# EAGLE schematic csa_cpu_v2.0h (EAGLE 4.15)
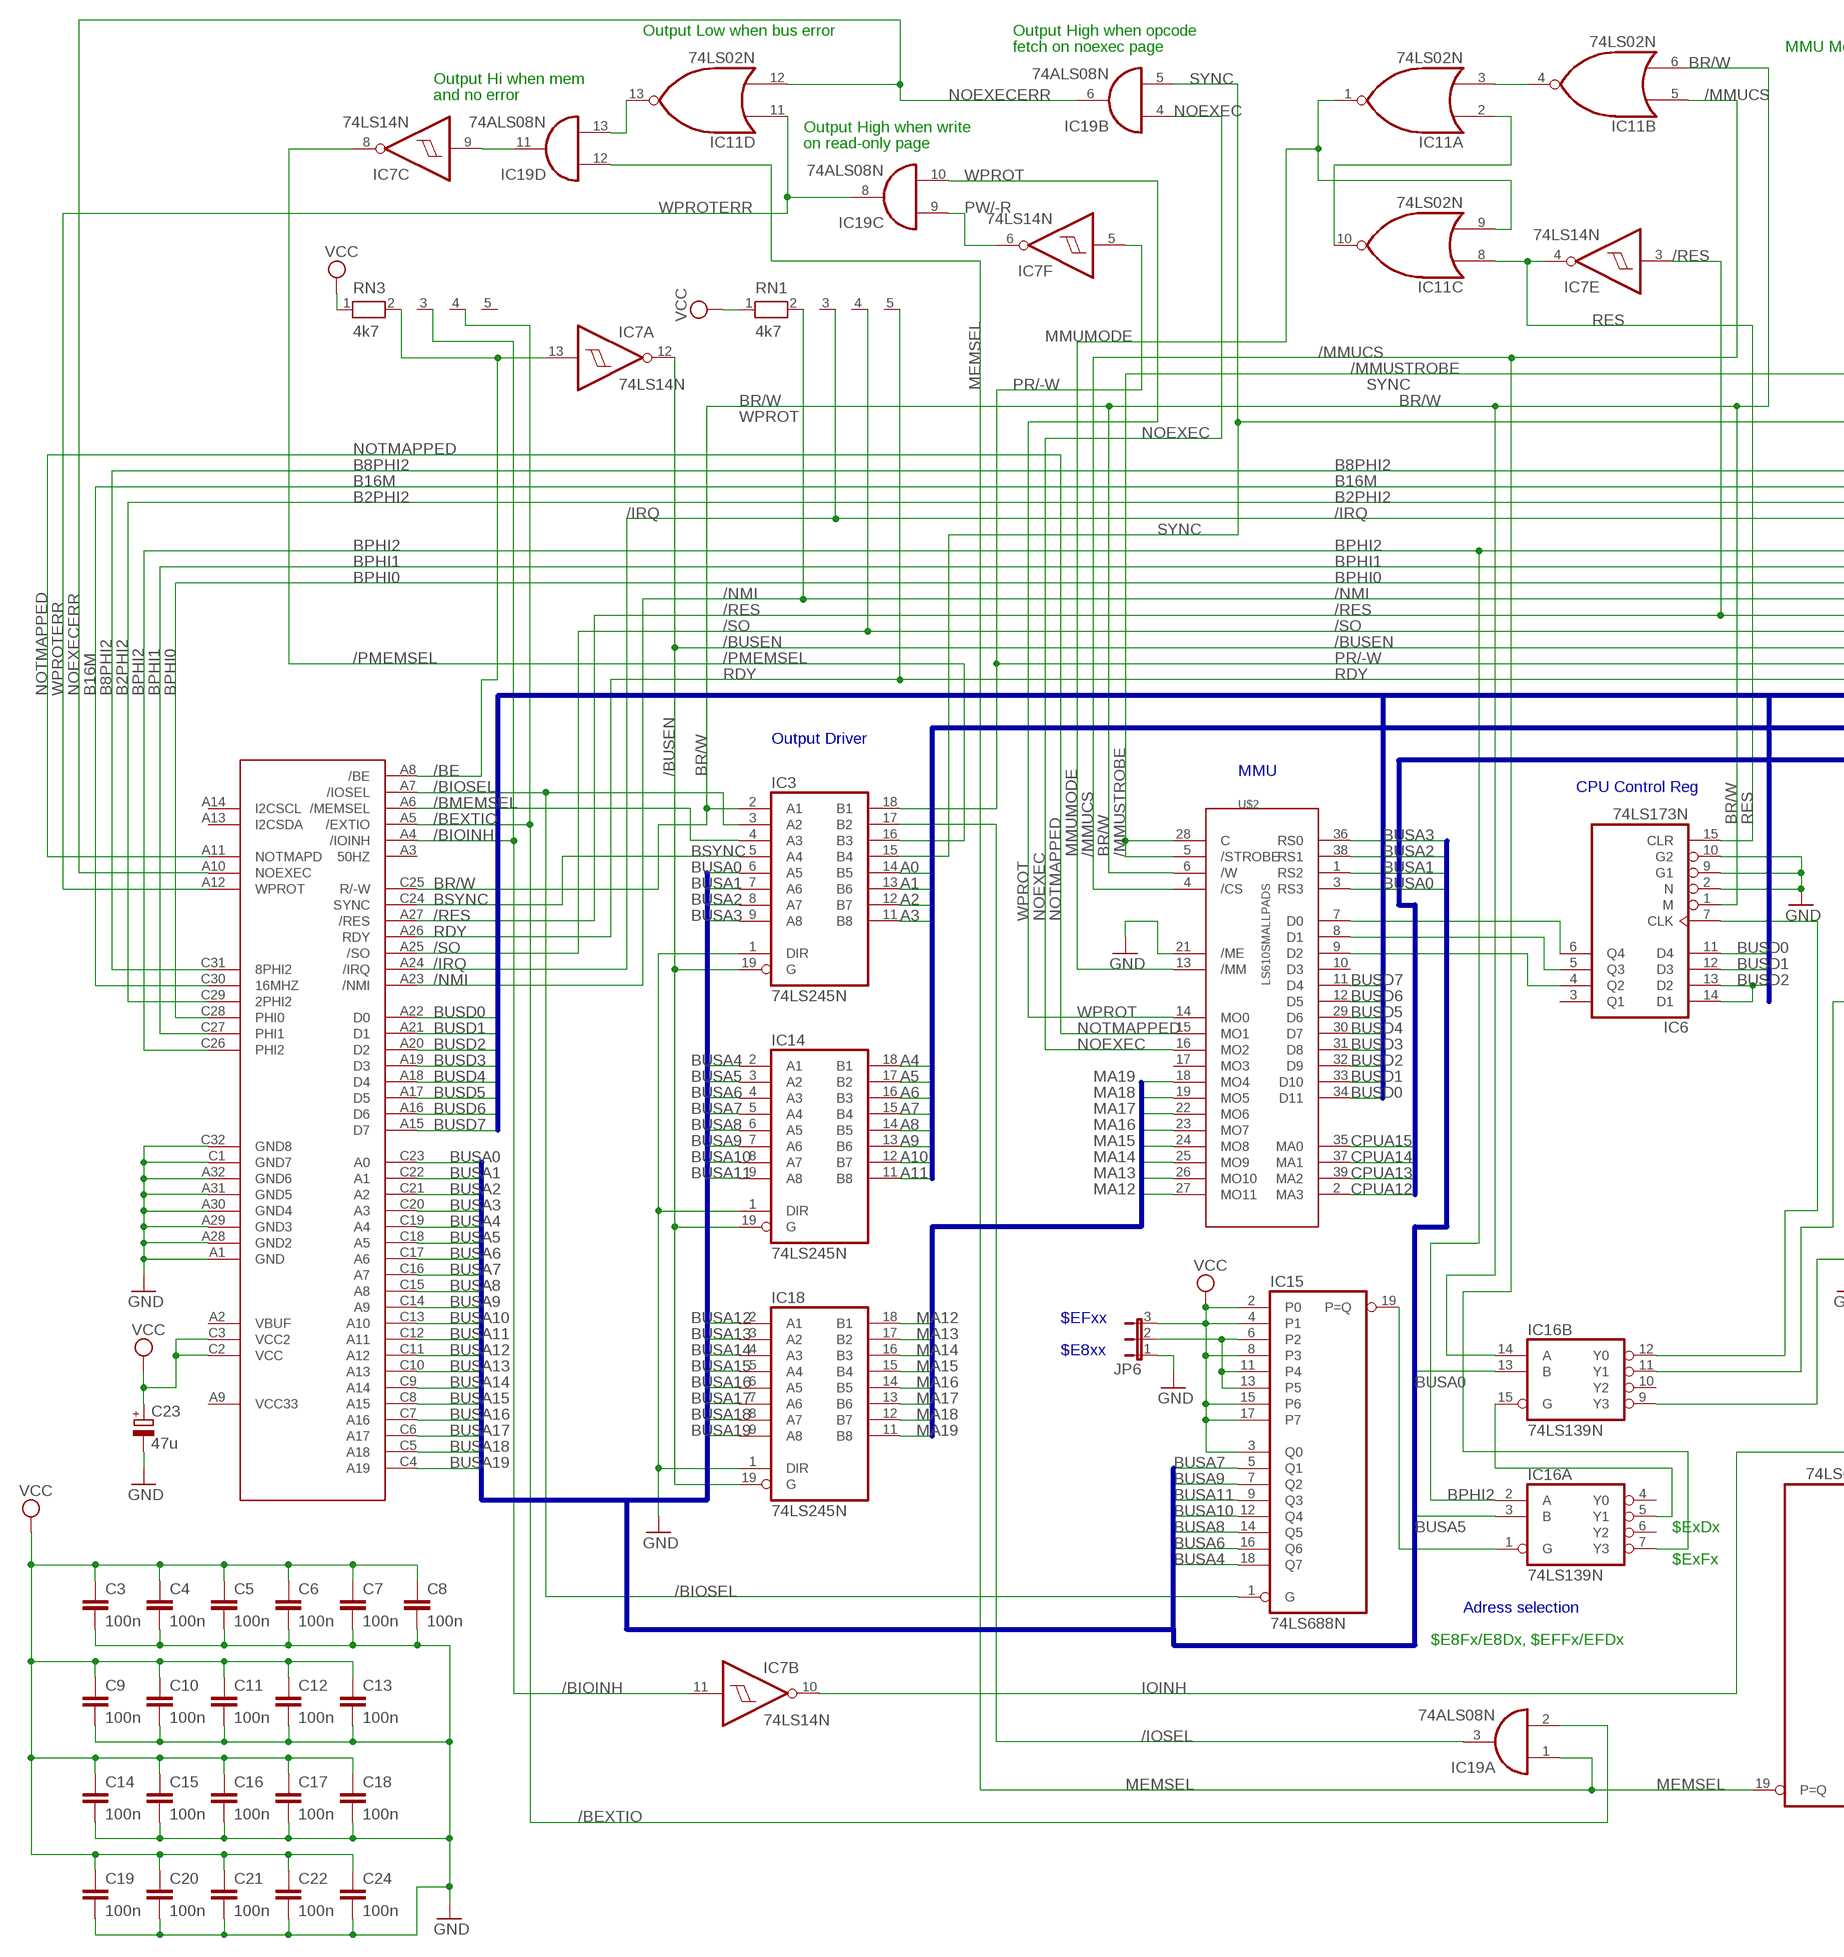
[diagram p0: schematic, sheet 1, part 1 of 2]
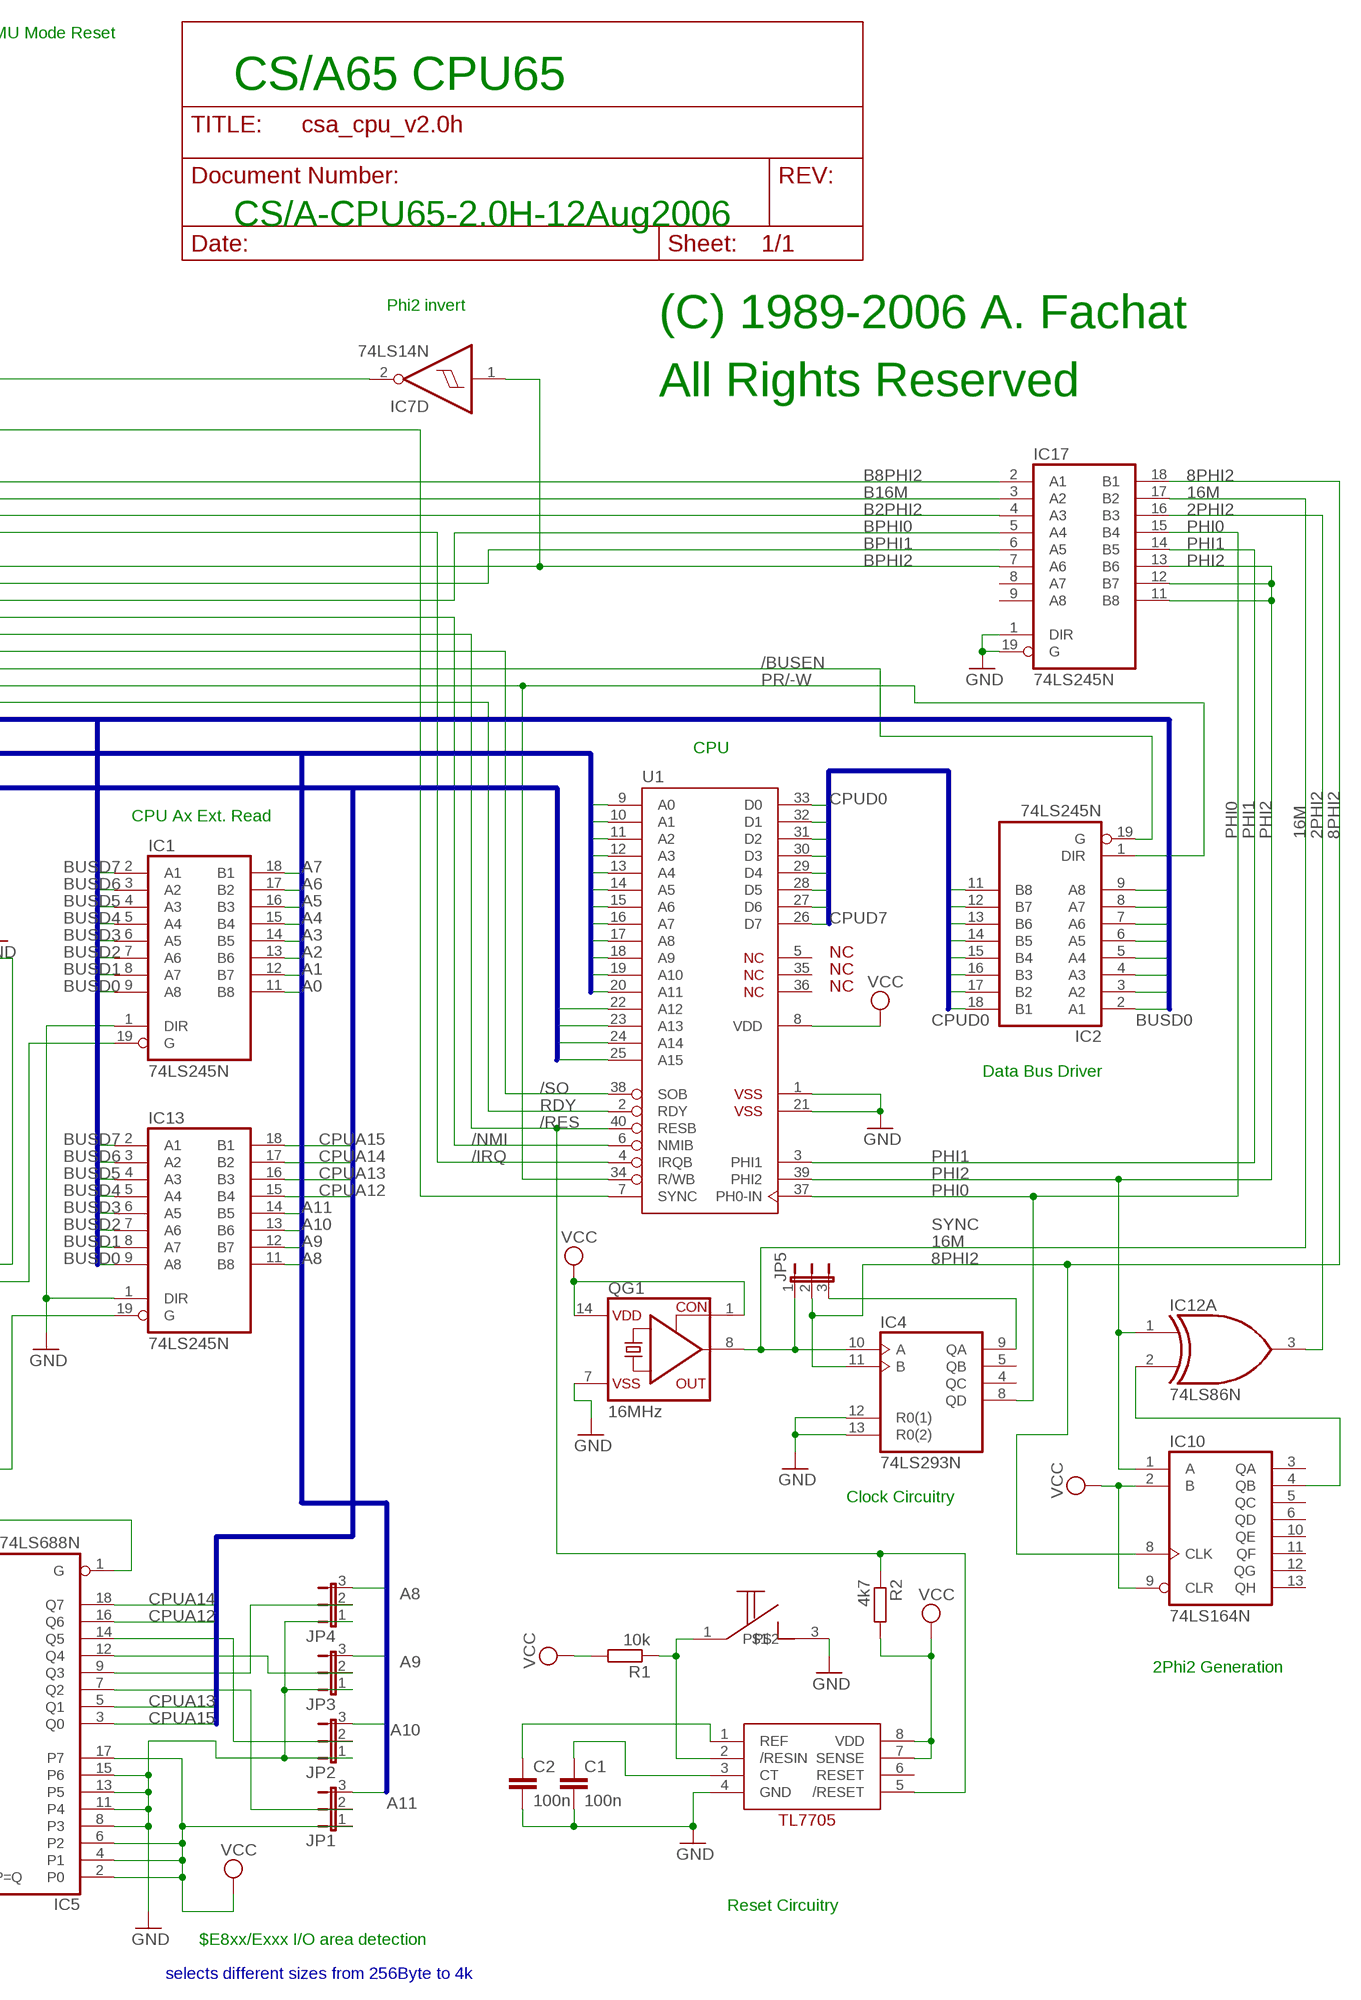
[diagram p1: schematic, sheet 1, part 2 of 2]

## Parts
C1  100n  C5/3.5  [C5B3.5]
C2  100n  C5/3.5  [C5B3.5]
C3  100n  C-EU025-025X050  [C025-025X050]
C4  100n  C-EU025-025X050  [C025-025X050]
C5  100n  C-EU025-025X050  [C025-025X050]
C6  100n  C-EU025-025X050  [C025-025X050]
C7  100n  C-EU025-025X050  [C025-025X050]
C8  100n  C-EU025-025X050  [C025-025X050]
C9  100n  C-EU025-025X050  [C025-025X050]
C10  100n  C-EU025-025X050  [C025-025X050]
C11  100n  C-EU025-025X050  [C025-025X050]
C12  100n  C-EU025-025X050  [C025-025X050]
C13  100n  C-EU025-025X050  [C025-025X050]
C14  100n  C-EU025-025X050  [C025-025X050]
C15  100n  C-EU025-025X050  [C025-025X050]
C16  100n  C-EU025-025X050  [C025-025X050]
C17  100n  C-EU025-025X050  [C025-025X050]
C18  100n  C-EU025-025X050  [C025-025X050]
C19  100n  C-EU025-025X050  [C025-025X050]
C20  100n  C-EU025-025X050  [C025-025X050]
C21  100n  C-EU025-025X050  [C025-025X050]
C22  100n  C-EU025-025X050  [C025-025X050]
C23  47u  CPOL-EUE2.5-7  [E2,5-7]
C24  100n  C-EU025-025X050  [C025-025X050]
IC1  74LS245N  [DIL20]
IC2  74LS245N  [DIL20]
IC3  74LS245N  [DIL20]
IC4  74LS293N  [DIL14]
IC5  74LS688N  [DIL20]
IC6  74LS173N  [DIL16]
IC7  74LS14N  [DIL14]
IC10  74LS164N  [DIL14]
IC11  74LS02N  [DIL14]
IC12  74LS86N  [DIL14]
IC13  74LS245N  [DIL20]
IC14  74LS245N  [DIL20]
IC15  74LS688N  [DIL20]
IC16  74LS139N  [DIL16]
IC17  74LS245N  [DIL20]
IC18  74LS245N  [DIL20]
IC19  74ALS08N  [DIL14]
JP1  JP2E  [JP2]
JP2  JP2E  [JP2]
JP3  JP2E  [JP2]
JP4  JP2E  [JP2]
JP5  JP2E  [JP2]
JP6  JP2E  [JP2]
QG1  16MHz  CRYSTAL_RES-SG51  [SG51]
R1  10k  R-EU_0207/10  [0207/10]
R2  4k7  R-EU_0207/10  [0207/10]
RN1  4k7  RN04  [RN-5]
RN3  4k7  RN04  [RN-5]
U1  G65SC02P  [DIP-40]
U$1  CSABUS  [CSABUS]
U$2  LS610SMALLPADS  [DIP40]
U$3  TL7705  [DIL08]
U$4  TASTER  [TASTER]

## Nets
2PHI2: IC12.3(A:O) IC17.16(B3)
8PHI2: IC4.11(B) IC10.8(CLK) IC17.18(B1) JP5.2
16M: IC4.10(A) IC17.17(B2) JP5.1 QG1.8(OUT)
/BE: IC7.13(A:I) RN3.2 U$1.A8(/BE)
/BEXTIO: IC19.2(A:I1) RN3.4 U$1.A5(/EXTIO)
/BIOINH: IC7.11(B:I) RN3.3 U$1.A4(/IOINH)
/BIOSEL: IC3.3(A2) IC15.1(G) U$1.A7(/IOSEL)
/BMEMSEL: IC3.4(A3) U$1.A6(/MEMSEL)
/BUSEN: IC2.19(G) IC3.19(G) IC7.12(A:O) IC14.19(G) IC18.19(G)
/IOSEL: IC3.17(B2) IC19.3(A:O)
/IRQ: RN1.3 U1.4(IRQB) U$1.A24(/IRQ)
/MMUCS: IC11.5(B:I0) IC16.7(A:Y3) U$2.4(/CS)
/MMUSTROBE: IC7.2(D:O) U$2.5(/STROBE) U$2.28(C)
/NMI: RN1.2 U1.6(NMIB) U$1.A23(/NMI)
/PMEMSEL: IC3.16(B3) IC7.8(C:O)
/RES: IC7.3(E:I) R2.1 U1.40(RESB) U$1.A27(/RES) U$3.5(/RESET)
/SO: RN1.4 U1.38(SOB) U$1.A25(/SO)
A0: IC1.11(B8) IC3.14(B5) U1.9(A0)
A1: IC1.12(B7) IC3.13(B6) U1.10(A1)
A2: IC1.13(B6) IC3.12(B7) U1.11(A2)
A3: IC1.14(B5) IC3.11(B8) U1.12(A3)
A4: IC1.15(B4) IC14.18(B1) U1.13(A4)
A5: IC1.16(B3) IC14.17(B2) U1.14(A5)
A6: IC1.17(B2) IC14.16(B3) U1.15(A6)
A7: IC1.18(B1) IC14.15(B4) U1.16(A7)
A8: IC13.11(B8) IC14.14(B5) JP4.3 U1.17(A8)
A9: IC13.12(B7) IC14.13(B6) JP3.3 U1.18(A9)
A10: IC13.13(B6) IC14.12(B7) JP2.3 U1.19(A10)
A11: IC13.14(B5) IC14.11(B8) JP1.3 U1.20(A11)
B2PHI2: IC17.4(A3) U$1.C29(2PHI2)
B8PHI2: IC17.2(A1) U$1.C31(8PHI2)
B16M: IC17.3(A2) U$1.C30(16MHZ)
BPHI0: IC17.5(A4) U$1.C28(PHI0)
BPHI1: IC17.6(A5) U$1.C27(PHI1)
BPHI2: IC7.1(D:I) IC16.2(A:A) IC17.7(A6) U$1.C26(PHI2)
BR/W: IC3.2(A1) IC6.1(M) IC11.6(B:I1) IC16.14(B:A) U$1.C25(R/-W) U$2.6(/W)
BSYNC: IC3.5(A4) U$1.C24(SYNC)
BUSA0: IC3.6(A5) IC16.13(B:B) U$1.C23(A0) U$2.3(RS3)
BUSA1: IC3.7(A6) U$1.C22(A1) U$2.1(RS2)
BUSA2: IC3.8(A7) U$1.C21(A2) U$2.38(RS1)
BUSA3: IC3.9(A8) U$1.C20(A3) U$2.36(RS0)
BUSA4: IC14.2(A1) IC15.18(Q7) U$1.C19(A4)
BUSA5: IC14.3(A2) IC16.3(A:B) U$1.C18(A5)
BUSA6: IC14.4(A3) IC15.16(Q6) U$1.C17(A6)
BUSA7: IC14.5(A4) IC15.5(Q1) U$1.C16(A7)
BUSA8: IC14.6(A5) IC15.14(Q5) U$1.C15(A8)
BUSA9: IC14.7(A6) IC15.7(Q2) U$1.C14(A9)
BUSA10: IC14.8(A7) IC15.12(Q4) U$1.C13(A10)
BUSA11: IC14.9(A8) IC15.9(Q3) U$1.C12(A11)
BUSA12: IC18.2(A1) U$1.C11(A12)
BUSA13: IC18.3(A2) U$1.C10(A13)
BUSA14: IC18.4(A3) U$1.C9(A14)
BUSA15: IC18.5(A4) U$1.C8(A15)
BUSA16: IC18.6(A5) U$1.C7(A16)
BUSA17: IC18.7(A6) U$1.C6(A17)
BUSA18: IC18.8(A7) U$1.C5(A18)
BUSA19: IC18.9(A8) U$1.C4(A19)
BUSD0: IC1.9(A8) IC2.2(A1) IC6.11(D4) IC13.9(A8) U$1.A22(D0) U$2.34(D11)
BUSD1: IC1.8(A7) IC2.3(A2) IC6.12(D3) IC13.8(A7) U$1.A21(D1) U$2.33(D10)
BUSD2: IC1.7(A6) IC2.4(A3) IC6.13(D2) IC6.14(D1) IC13.7(A6) U$1.A20(D2) U$2.32(D9)
BUSD3: IC1.6(A5) IC2.5(A4) IC13.6(A5) U$1.A19(D3) U$2.31(D8)
BUSD4: IC1.5(A4) IC2.6(A5) IC13.5(A4) U$1.A18(D4) U$2.30(D7)
BUSD5: IC1.4(A3) IC2.7(A6) IC13.4(A3) U$1.A17(D5) U$2.29(D6)
BUSD6: IC1.3(A2) IC2.8(A7) IC13.3(A2) U$1.A16(D6) U$2.12(D5)
BUSD7: IC1.2(A1) IC2.9(A8) IC13.2(A1) U$1.A15(D7) U$2.11(D4)
CPUA12: IC5.16(Q6) IC13.15(B4) U1.22(A12) U$2.2(MA3)
CPUA13: IC5.5(Q1) IC13.16(B3) U1.23(A13) U$2.39(MA2)
CPUA14: IC5.18(Q7) IC13.17(B2) U1.24(A14) U$2.37(MA1)
CPUA15: IC5.3(Q0) IC13.18(B1) U1.25(A15) U$2.35(MA0)
CPUD0: IC2.18(B1) U1.33(D0)
CPUD1: IC2.17(B2) U1.32(D1)
CPUD2: IC2.16(B3) U1.31(D2)
CPUD3: IC2.15(B4) U1.30(D3)
CPUD4: IC2.14(B5) U1.29(D4)
CPUD5: IC2.13(B6) U1.28(D5)
CPUD6: IC2.12(B7) U1.27(D6)
CPUD7: IC2.11(B8) U1.26(D7)
GND: C1.2 C2.2 C3.2 C4.2 C5.2 C6.2 C7.2 C8.2 C9.2 C10.2 C11.2 C12.2 C13.2 C14.2 C15.2 C16.2 C17.2 C18.2 C19.2 C20.2 C21.2 C22.2 C23.- C24.2 IC1.1(DIR) IC3.1(DIR) IC4.12(R0(1)) IC4.13(R0(2)) IC5.8(P3) IC5.11(P4) IC5.13(P5) IC5.15(P6) IC6.2(N) IC6.9(G1) IC6.10(G2) IC13.1(DIR) IC14.1(DIR) IC17.1(DIR) IC17.19(G) IC18.1(DIR) JP2.1 JP3.1 JP4.1 JP6.1 QG1.7(VSS) U1.1(VSS$1) U1.21(VSS$2) U$1.A1(GND) U$1.A28(GND2) U$1.A29(GND3) U$1.A30(GND4) U$1.A31(GND5) U$1.A32(GND6) U$1.C1(GND7) U$1.C32(GND8) U$2.21(/ME) U$3.4(GND) U$4.3
IOINH: IC5.1(G) IC7.10(B:O)
MA12: IC18.18(B1) U$2.27(MO11)
MA13: IC18.17(B2) U$2.26(MO10)
MA14: IC18.16(B3) U$2.25(MO9)
MA15: IC18.15(B4) U$2.24(MO8)
MA16: IC18.14(B5) U$2.23(MO7)
MA17: IC18.13(B6) U$2.22(MO6)
MA18: IC18.12(B7) U$2.19(MO5)
MA19: IC18.11(B8) U$2.18(MO4)
MEMSEL: IC5.19(P=Q) IC19.1(A:I0) IC19.12(D:I0)
MMUMODE: IC11.1(A:O) IC11.9(C:I1) U$2.13(/MM)
N$1: IC10.4(QB) IC12.2(A:I1)
N$2: C2.1 U$3.1(REF)
N$3: IC6.4(Q2) U$2.9(D2)
N$4: IC11.3(A:I1) IC11.4(B:O)
N$5: IC5.9(Q3) JP4.2
N$6: IC5.12(Q4) JP3.2
N$7: IC5.14(Q5) JP2.2
N$8: IC5.7(Q2) JP1.2
N$17: R1.1 U$3.2(/RESIN) U$4.1
N$19: C1.1 U$3.3(CT)
N$20: IC6.5(Q3) U$2.8(D1)
N$22: IC4.9(QA) JP5.3
N$24: IC11.2(A:I0) IC11.10(C:O)
N$25: IC11.13(D:O) IC19.13(D:I1)
N$26: IC7.9(C:I) IC19.11(D:O)
N$58: IC1.19(G) IC16.11(B:Y1)
N$64: IC15.6(P2) IC15.11(P4) IC15.13(P5) JP6.2
N$65: IC15.19(P=Q) IC16.1(A:G)
N$66: IC13.19(G) IC16.9(B:Y3)
N$68: IC16.5(A:Y1) IC16.15(B:G)
N$69: IC6.7(CLK) IC16.12(B:Y0)
N$72: IC6.6(Q4) U$2.7(D0)
NOEXEC: IC19.4(B:I0) U$2.16(MO2)
NOEXECERR: IC11.12(D:I1) IC19.6(B:O) U$1.A10(NOEXEC)
NOTMAPPED: U$1.A11(NOTMAPD) U$2.15(MO1)
PHI0: IC4.8(QD) IC17.15(B4) U1.37(PH0-IN)
PHI1: IC17.14(B5) U1.3(PHI1)
PHI2: IC10.1(A) IC12.1(A:I0) IC17.11(B8) IC17.12(B7) IC17.13(B6) U1.39(PHI2)
PR/-W: IC2.1(DIR) IC3.18(B1) IC7.5(F:I) U1.34(R/WB)
PW/-R: IC7.6(F:O) IC19.9(C:I0)
RDY: RN1.5 U1.2(RDY) U$1.A26(RDY)
RES: IC6.15(CLR) IC7.4(E:O) IC11.8(C:I0)
SYNC: IC3.15(B4) IC19.5(B:I1) U1.7(SYNC)
VCC: C3.1 C4.1 C5.1 C6.1 C7.1 C8.1 C9.1 C10.1 C11.1 C12.1 C13.1 C14.1 C15.1 C16.1 C17.1 C18.1 C19.1 C20.1 C21.1 C22.1 C23.+ C24.1 IC5.2(P0) IC5.4(P1) IC5.6(P2) IC5.17(P7) IC10.2(B) IC10.9(CLR) IC15.2(P0) IC15.3(Q0) IC15.4(P1) IC15.8(P3) IC15.15(P6) IC15.17(P7) JP1.1 JP6.3 QG1.1(CON) QG1.14(VDD) R1.2 R2.2 RN1.1 RN3.1 U1.8(VDD) U$1.C2(VCC) U$1.C3(VCC2) U$3.7(SENSE) U$3.8(VDD)
WPROT: IC19.10(C:I1) U$2.14(MO0)
WPROTERR: IC11.11(D:I0) IC19.8(C:O) U$1.A12(WPROT)
Unconnected: IC4.4(QC) IC4.5(QB) IC6.3(Q1) IC10.3(QA) IC10.5(QC) IC10.6(QD) IC10.10(QE) IC10.11(QF) IC10.12(QG) IC10.13(QH) IC12.4(B:I0) IC12.5(B:I1) IC12.6(B:O) IC12.8(C:O) IC12.9(C:I0) IC12.10(C:I1) IC12.11(D:O) IC12.12(D:I0) IC12.13(D:I1) IC16.4(A:Y0) IC16.6(A:Y2) IC16.10(B:Y2) IC17.8(A7) IC17.9(A8) RN3.5 U1.5(NC$1) U1.35(NC$2) U1.36(NC$3) U$1.A2(VBUF) U$1.A3(50HZ) U$1.A9(VCC33) U$1.A13(I2CSDA) U$1.A14(I2CSCL) U$2.10(D3) U$2.17(MO3) U$3.6(RESET)

## Buses
CPUD[0..7]
A[0..11]
CPUA[12..15]
BUSD[0..7]
MA[12..19]
BUSA[0..19]

## Notes on the sheet
- Output Low when bus error | Output High when opcode
- fetch on noexec page | MMU Mode Reset
- Output Hi when mem
- and no error | CS/A65 CPU65
- Output High when write
- on read-only page
- CS/A-CPU65-2.0H-12Aug2006
- Phi2 invert
- (C) 1989-2006 A. Fachat
- All Rights Reserved
- CPU
- Output Driver
- MMU
- CPU Control Reg | CPU Ax Ext. Read
- Data Bus Driver
- $EFxx
- $E8xx
- Clock Circuitry
- $ExDx
- $ExFx
- 2Phi2 Generation
- Adress selection
- $E8Fx/E8Dx, $EFFx/EFDx
- Reset Circuitry
- $E8xx/Exxx I/O area detection
- selects different sizes from 256Byte to 4k

## Power pins joined to a net without a drawn wire
GND: IC1.10(GND) IC2.10(GND) IC3.10(GND) IC4.7(GND) IC5.10(GND) IC6.8(GND) IC7.7(P:GND) IC10.7(GND) IC11.7(P:GND) IC12.7(P:GND) IC13.10(GND) IC14.10(GND) IC15.10(GND) IC16.8(P:GND) IC17.10(GND) IC18.10(GND) IC19.7(P:GND) U$2.20(GND)
VCC: IC1.20(VCC) IC2.20(VCC) IC3.20(VCC) IC4.14(VCC) IC5.20(VCC) IC6.16(VCC) IC7.14(P:VCC) IC10.14(VCC) IC11.14(P:VCC) IC12.14(P:VCC) IC13.20(VCC) IC14.20(VCC) IC15.20(VCC) IC16.16(P:VCC) IC17.20(VCC) IC18.20(VCC) IC19.14(P:VCC) U$2.40(VCC)

## Library data of the parts
C1 C2 = capacitor-wima:C: CAPACITOR naming: grid - package width
C3-C22 C24 = rcl:C-EU: CAPACITOR, European symbol
C23 = rcl:CPOL-EU: POLARIZED CAPACITOR, European symbol
IC1-IC3 IC13 IC14 IC17 IC18 = 74xx-us:74*245: Octal BUS TRANSCEIVER, 3-state
IC4 = 74xx-eu:74*293: Decade and 4-bit BINARY COUNTER
IC5 IC15 = 74xx-us:74*688: 8-bit MAGNITUDE/IDENTITY COMPARATOR, totem pole
IC6 = 74xx-us:74*173: 4-bit D type REGISTER, 3-state
IC7 = 74xx-eu:74*14: Hex schmitt trigger INVERTER
IC10 = 74xx-eu:74*164: 8-bit parallel out SHIFT REGISTER
IC11 = 74xx-us:74*02: Quad 2-input NOR gate
IC12 = 74xx-us:74*86: Quad 2-input EXCLUSIV-OR (XOR) gate
IC16 = 74xx-eu:74*139: Dual 2-line to 4-line DECODER/DEMULTIPLEXER
IC19 = 74xx-eu:74*08: Quad 2-input AND gate
JP1-JP6 = jumper:JP2E: JUMPER
QG1 = crystal:CRYSTAL_RES-: CRYSTAL RESONATOR
R1 R2 = rcl:R-EU_: RESISTOR, European symbol
RN1 RN3 = resistor-net:RN04: RESISTOR NETWORK
U1 = 65xxx:G65SC02P: California Micro Devices Version
U$1 = csa:CSABUS
U$2 = csa:LS610
U$3 = csa:TL7705
U$4 = csa:TASTER